# Altium schematic sheet CW308_Mechanical.SchDoc: Mechanical & Notes
size Letter; ApprovedBy: N; Organization: NewAE Technology Inc.; Address1: 1083 Queen St., Suite 196; Address2: Halifax; Address3: NS; Address4: Canada B3H 0B2; DocumentNumber: 1; SheetNumber: 1; SheetTotal: 5; SheetApproved: YES
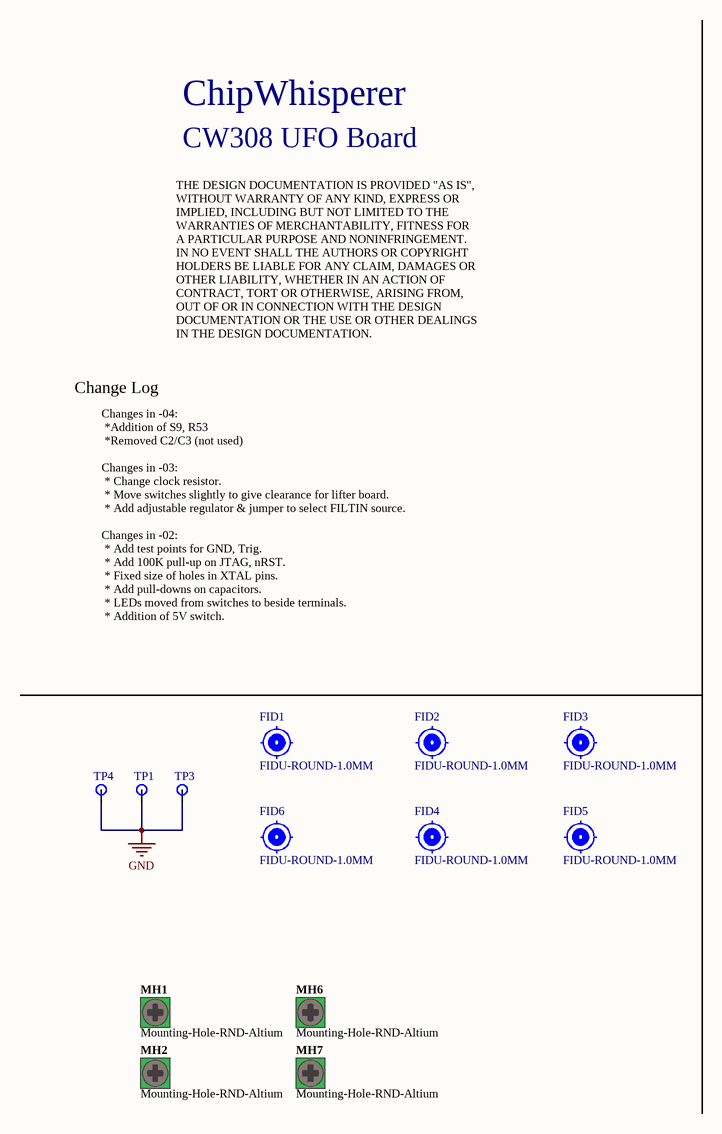
[diagram p0: CW308_Mechanical.SchDoc]

## Parts
FID1  FIDU-ROUND-1.0MM  [FIDU-ROUND-1.0mm]  (no BOM)
FID2  FIDU-ROUND-1.0MM  [FIDU-ROUND-1.0mm]  (no BOM)
FID3  FIDU-ROUND-1.0MM  [FIDU-ROUND-1.0mm]  (no BOM)
FID4  FIDU-ROUND-1.0MM  [FIDU-ROUND-1.0mm]  (no BOM)
FID5  FIDU-ROUND-1.0MM  [FIDU-ROUND-1.0mm]  (no BOM)
FID6  FIDU-ROUND-1.0MM  [FIDU-ROUND-1.0mm]  (no BOM)
MH1  Mounting-Hole-RND-Altium  [Mounting-Hole-RND-Altium]  (no BOM)
MH2  Mounting-Hole-RND-Altium  [Mounting-Hole-RND-Altium]  (no BOM)
MH6  Mounting-Hole-RND-Altium  [Mounting-Hole-RND-Altium]  (no BOM)
MH7  Mounting-Hole-RND-Altium  [Mounting-Hole-RND-Altium]  (no BOM)
TP1  5011  [KEYSTONE5011]  (value not drawn)
TP3  5011  [KEYSTONE5011]  (value not drawn)
TP4  5011  [KEYSTONE5011]  (value not drawn)

## Nets
GND: TP1.1 TP3.1 TP4.1

Not connected (* = marked no-connect by the designer): MH1 1; MH2 1; MH6 1; MH7 1

## Notes on the sheet
- CW308 UFO Board
- ChipWhisperer
- THE DESIGN DOCUMENTATION IS PROVIDED "AS IS",
  WITHOUT WARRANTY OF ANY KIND, EXPRESS OR
  IMPLIED, INCLUDING BUT NOT LIMITED TO THE
  WARRANTIES OF MERCHANTABILITY, FITNESS FOR
  A PARTICULAR PURPOSE AND NONINFRINGEMENT.
  IN NO EVENT SHALL THE AUTHORS OR COPYRIGHT
  HOLDERS BE LIABLE FOR ANY CLAIM, DAMAGES OR
  OTHER LIABILITY, WHETHER IN AN ACTION OF
  CONTRACT, TORT OR OTHERWISE, ARISING FROM,
  OUT OF OR IN CONNECTION WITH THE DESIGN
  DOCUMENTATION OR THE USE OR OTHER DEALINGS
  IN THE DESIGN DOCUMENTATION.
- Change Log
- Changes in -04:
  *Addition of S9, R53
  *Removed C2/C3 (not used)
  Changes in -03:
  * Change clock resistor.
  * Move switches slightly to give clearance for lifter board.
  * Add adjustable regulator & jumper to select FILTIN source.
  Changes in -02:
  * Add test points for GND, Trig.
  * Add 100K pull-up on JTAG, nRST.
  * Fixed size of holes in XTAL pins.
  * Add pull-downs on capacitors.
  * LEDs moved from switches to beside terminals.
  * Addition of 5V switch.
- Title:
- Date:
- Rev:
- Time:
- Project:
- Sheet
- of
- License:
- Copyright © NewAE Technology Inc.
- Approved:
- NewAE.com
- File:

## Library data of the parts
FID1-FID6 = FIDU-ROUND-1.0MM: ROUND FIDUCIAL
MH1 MH2 MH6 MH7 = CMP-0001-00029-1: Mounting Hole, Altium, 4.4mm pad, 3.4mm plated hole; Publisher: Altium; ClassName: Mounting Hole
TP1 TP3 TP4 = KEYSTONE_5011: TEST POINT PC MULTI PURPOSE BLK; Supplier 1: Digi-Key; Supplier Part Number 1: 36-5011-ND